# Altium project Button Board.PrjPcb
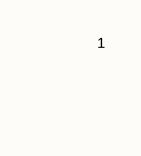
[diagram p0: Button Board.SchDoc, top right]
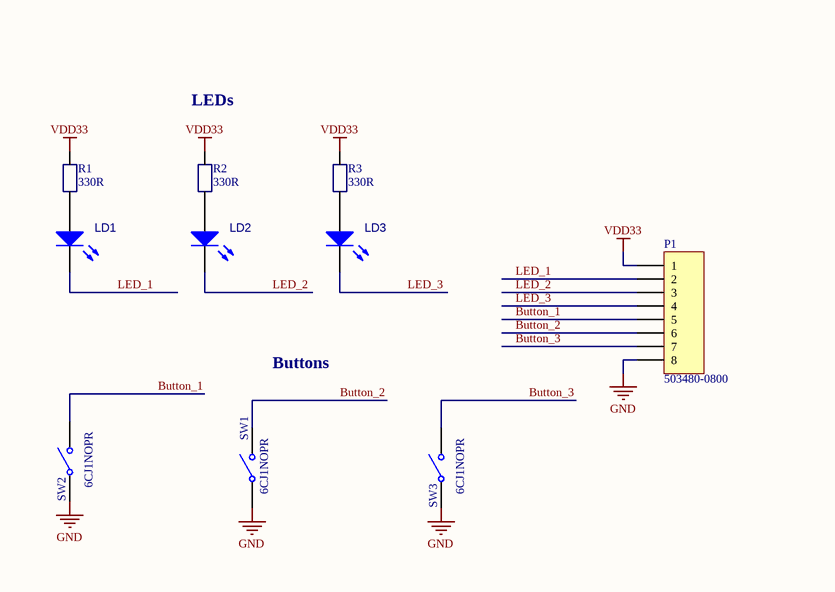
[diagram p1: Button Board.SchDoc, bottom left]
1 sheet, 10 parts. Net scope: global (net labels, ports and power ports of the same name join across sheets).
Board file: Button Board.PcbDoc

## Sheet Button Board.SchDoc: WiFI Camera. Button Board
size A4; Revision: Rev 2.0; SheetNumber: 1

### Parts
LD1  BLUE  [LEDC1608X80N_RED]  (value not drawn)
LD2  BLUE  [LEDC1608X80N_RED]  (value not drawn)
LD3  BLUE  [LEDC1608X80N_RED]  (value not drawn)
P1  503480-0800  [503480-0800]
R1  330R  [RESC1608X50N]
R2  330R  [RESC1608X50N]
R3  330R  [RESC1608X50N]
SW1  6CJ1NOPR  [Ultranavi_10G]
SW2  6CJ1NOPR  [Ultranavi_10S]
SW3  6CJ1NOPR  [Ultranavi_10S]

### Nets
GND: P1.8 SW1.1(COMMON) SW2.1(COMMON) SW3.1(COMMON)
VDD33: P1.1 R1.2 R2.2 R3.2
Button_1: P1.5 SW2.2(NO)
Button_2: P1.6 SW1.2(NO)
Button_3: P1.7 SW3.2(NO)
LED_1: LD1.2(K) P1.2
LED_2: LD2.2(K) P1.3
LED_3: LD3.2(K) P1.4
NetLD1_1: LD1.1(A) R1.1
NetLD2_1: LD2.1(A) R2.1
NetLD3_1: LD3.1(A) R3.1

### Notes on the sheet
- 1
- LEDs
- Buttons
- Title
- Size:
- Date:
- A4
- Number:
- Time:
- Revision:
- Sheet
- of
- File:

### Library data of the parts
LD1-LD3 = LED_GREEN_0603_THG1111C-0005-TR: LED; 6. MANUF INST: ALTERNATIVE; 2. VALUE: LED GREEN 100mcd; 3. MAN BRAND: Stanley; 7. PACKAGE: 0603; 8. PINS: 2; 9. TYPE: SMD; 4. MAN P/N: THG1111C-0005-TR; 5. DATASHEET LINK: https://www.mouser.com/datasheet/2/917/stanley_led_2018_02-1504930.pdf
P1 = Header 8: Header, 8-Pin; LatestRevisionDate: 17-Jul-2002; LatestRevisionNote: Re-released for DXP Platform.; Publisher: Altium Limited
R1-R3 = Resistor: Value: 330
SW1-SW3 = SW-SPST: 2.5mm 1.6mm Round Button 50mA Brick nogging 3mm SPST 12V SMD,2.5x3mm  Tactile Switches ROHS